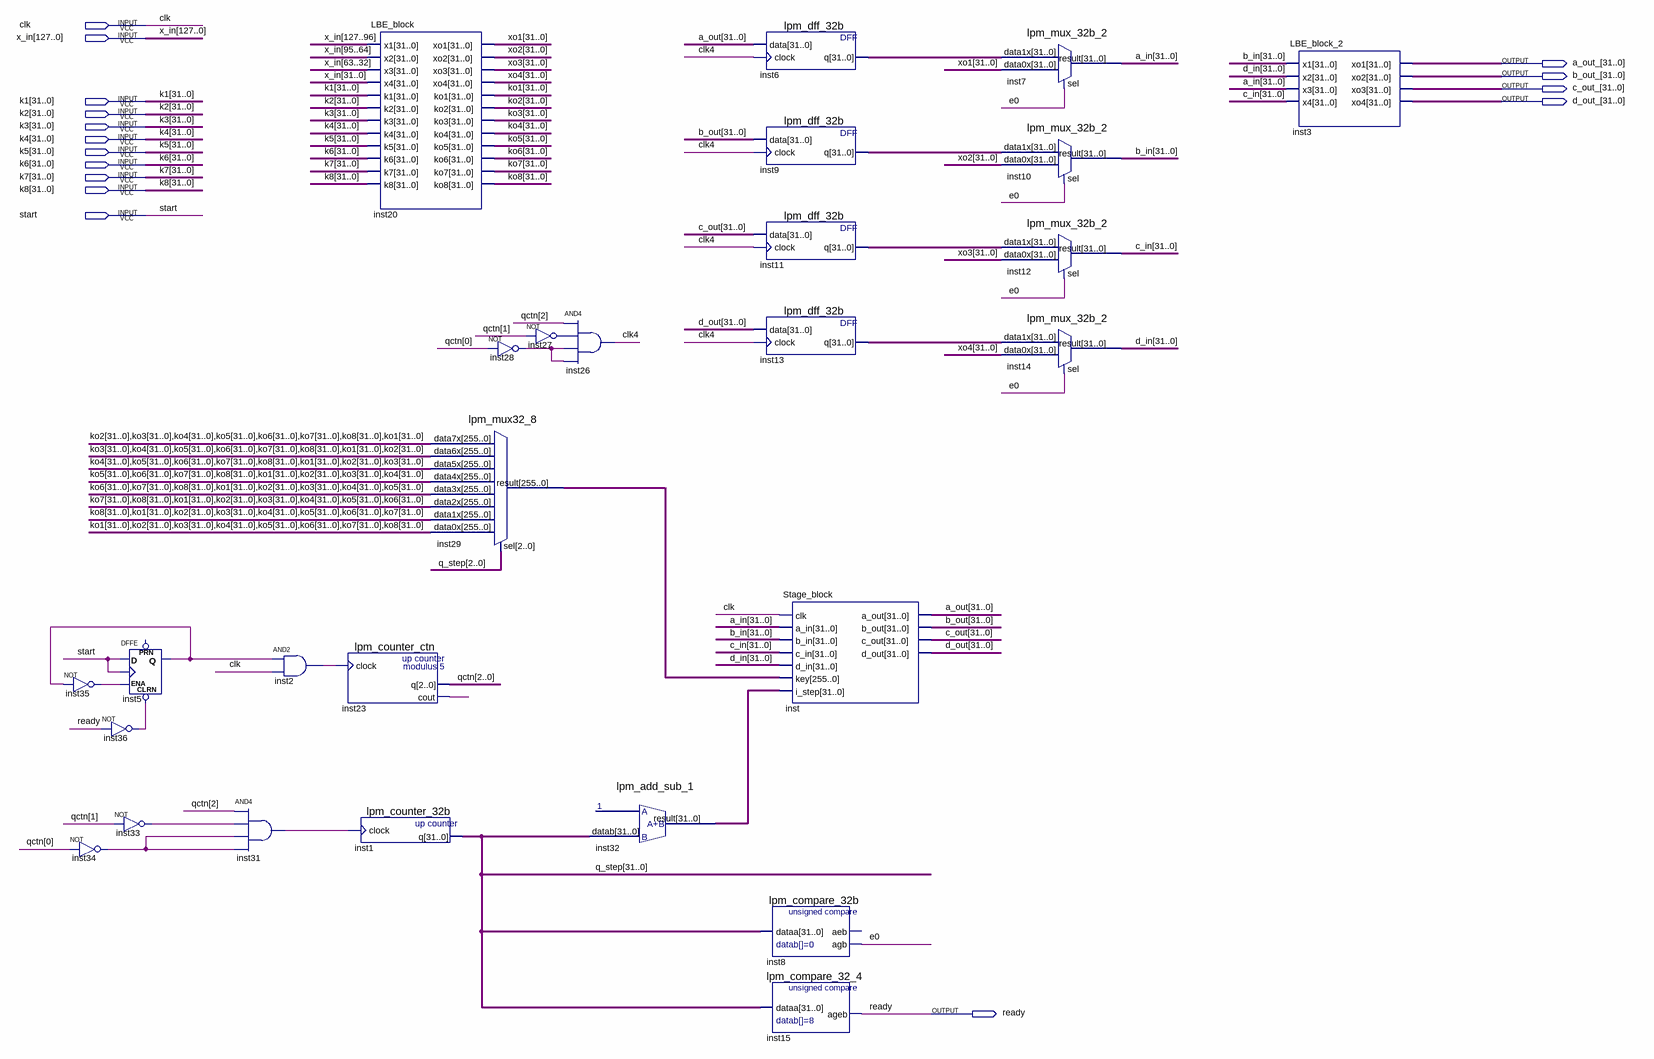
[diagram p0: schematic sheet]
// Quartus schematic F0.bdf as structural Verilog: 27 symbols, 16 pins
module F0 (
  input  clk,
  input  [127:0] x_in,
  input  [31:0] k1,
  input  [31:0] k2,
  input  [31:0] k3,
  input  [31:0] k4,
  input  [31:0] k5,
  input  [31:0] k6,
  input  [31:0] k7,
  input  [31:0] k8,
  input  start,
  output [31:0] a_out_,
  output [31:0] b_out_,
  output [31:0] c_out_,
  output [31:0] d_out_,
  output ready
);

  wire clk4, e0, inst2_out, inst5_q, inst23_cout, inst27_out, inst28_out, inst31_out, inst33_out, inst34_out,
       inst35_out, inst36_out;
  wire [2:0] qctn;
  wire [31:0] a_in, a_out, b_in, b_out, c_in, c_out, d_in, d_out, inst6_q, inst9_q, inst11_q, inst13_q,
       inst32_result, ko1, ko2, ko3, ko4, ko5, ko6, ko7, ko8, q_step, xo1, xo2, xo3, xo4;
  wire [255:0] inst29_result;

  not inst35 (inst35_out, inst5_q);
  not inst34 (inst34_out, qctn[0]);
  DFFE inst5 (.CLRN(inst36_out), .D(start), .CLK(start), .ENA(inst35_out), .Q(inst5_q));  // open: PRN
  not inst36 (inst36_out, ready);
  not inst33 (inst33_out, qctn[1]);
  and inst31 (inst31_out, qctn[2], inst33_out, inst34_out, inst34_out);
  and inst2 (inst2_out, inst5_q, clk);
  lpm_counter_ctn inst23 (.clock(inst2_out), .q(qctn), .cout(inst23_cout));
  lpm_counter_32b inst1 (.clock(inst31_out), .q(q_step));
  LBE_block inst20 (
    .x1(x_in[127:96]), .x2(x_in[95:64]), .x3(x_in[63:32]), .x4(x_in[31:0]), .k1(k1), .k2(k2), .k3(k3),
    .k4(k4), .k5(k5), .k6(k6), .k7(k7), .k8(k8), .xo1(xo1), .xo2(xo2), .xo3(xo3), .xo4(xo4), .ko1(ko1),
    .ko2(ko2), .ko3(ko3), .ko4(ko4), .ko5(ko5), .ko6(ko6), .ko7(ko7), .ko8(ko8));
  lpm_mux32_8 inst29 (
    .data7x({ko2, ko3, ko4, ko5, ko6, ko7, ko8, ko1}), .data6x({ko3, ko4, ko5, ko6, ko7, ko8, ko1, ko2}),
    .data5x({ko4, ko5, ko6, ko7, ko8, ko1, ko2, ko3}), .data4x({ko5, ko6, ko7, ko8, ko1, ko2, ko3, ko4}),
    .data3x({ko6, ko7, ko8, ko1, ko2, ko3, ko4, ko5}), .data2x({ko7, ko8, ko1, ko2, ko3, ko4, ko5, ko6}),
    .data1x({ko8, ko1, ko2, ko3, ko4, ko5, ko6, ko7}), .data0x({ko1, ko2, ko3, ko4, ko5, ko6, ko7, ko8}),
    .sel(q_step[2:0]), .result(inst29_result));
  not inst28 (inst28_out, qctn[0]);
  not inst27 (inst27_out, qctn[1]);
  and inst26 (clk4, qctn[2], inst27_out, inst28_out, inst28_out);
  lpm_add_sub_1 inst32 (.datab(q_step), .result(inst32_result));
  lpm_dff_32b inst6 (.data(a_out), .clock(clk4), .q(inst6_q));
  lpm_dff_32b inst9 (.data(b_out), .clock(clk4), .q(inst9_q));
  lpm_dff_32b inst11 (.data(c_out), .clock(clk4), .q(inst11_q));
  lpm_dff_32b inst13 (.data(d_out), .clock(clk4), .q(inst13_q));
  Stage_block inst (
    .clk(clk), .a_in(a_in), .b_in(b_in), .c_in(c_in), .d_in(d_in), .key(inst29_result),
    .i_step(inst32_result), .a_out(a_out), .b_out(b_out), .c_out(c_out), .d_out(d_out));
  lpm_compare_32b inst8 (.dataa(q_step), .agb(e0));  // open: aeb
  lpm_compare_32_4 inst15 (.dataa(q_step), .ageb(ready));
  lpm_mux_32b_2 inst7 (.data1x(inst6_q), .data0x(xo1), .sel(e0), .result(a_in));
  lpm_mux_32b_2 inst10 (.data1x(inst9_q), .data0x(xo2), .sel(e0), .result(b_in));
  lpm_mux_32b_2 inst12 (.data1x(inst11_q), .data0x(xo3), .sel(e0), .result(c_in));
  lpm_mux_32b_2 inst14 (.data1x(inst13_q), .data0x(xo4), .sel(e0), .result(d_in));
  LBE_block_2 inst3 (
    .x1(b_in), .x2(d_in), .x3(a_in), .x4(c_in), .xo1(a_out_), .xo2(b_out_), .xo3(c_out_), .xo4(d_out_));
endmodule
